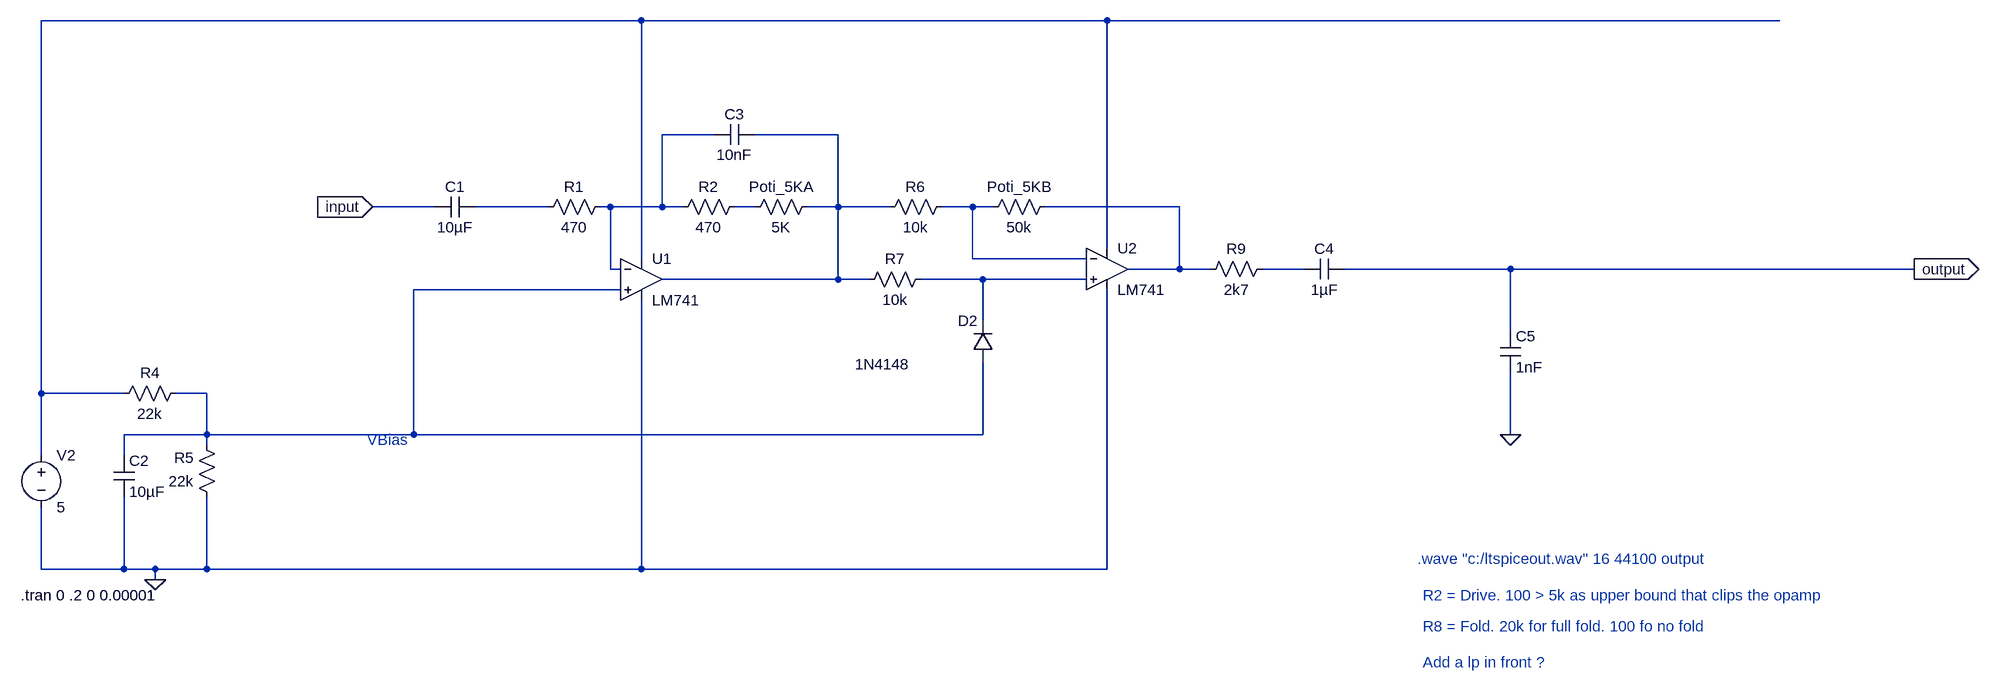
[diagram p0: schematic WaveFolder2.asc]
WaveFolder2.asc, the LTspice schematic file:
Version 4
SHEET 1 1856 720
WIRE -256 -288 -1184 -288
WIRE 464 -288 -256 -288
WIRE 1504 -288 464 -288
WIRE -144 -112 -224 -112
WIRE 48 -112 -80 -112
WIRE -576 0 -672 0
WIRE -400 0 -512 0
WIRE -304 0 -320 0
WIRE -224 0 -224 -112
WIRE -224 0 -304 0
WIRE -192 0 -224 0
WIRE -80 0 -112 0
WIRE 48 0 48 -112
WIRE 48 0 0 0
WIRE 128 0 48 0
WIRE 256 0 208 0
WIRE 288 0 256 0
WIRE 576 0 368 0
WIRE 464 64 464 -288
WIRE -256 80 -256 -288
WIRE 256 80 256 0
WIRE 432 80 256 80
WIRE -304 96 -304 0
WIRE -288 96 -304 96
WIRE 576 96 576 0
WIRE 576 96 496 96
WIRE 624 96 576 96
WIRE 768 96 704 96
WIRE 1088 96 832 96
WIRE 1712 96 1088 96
WIRE 48 112 48 0
WIRE 48 112 -224 112
WIRE 96 112 48 112
WIRE 272 112 176 112
WIRE 432 112 272 112
WIRE -288 128 -608 128
WIRE 272 176 272 112
WIRE 1088 192 1088 96
WIRE -1184 288 -1184 -288
WIRE -1056 288 -1184 288
WIRE -928 288 -976 288
WIRE -928 352 -928 288
WIRE -928 352 -1056 352
WIRE -608 352 -608 128
WIRE -608 352 -928 352
WIRE 272 352 272 240
WIRE 272 352 -608 352
WIRE 1088 352 1088 256
WIRE -928 368 -928 352
WIRE -1184 384 -1184 288
WIRE -1056 384 -1056 352
WIRE -1184 560 -1184 464
WIRE -1056 560 -1056 448
WIRE -1056 560 -1184 560
WIRE -1008 560 -1056 560
WIRE -928 560 -928 448
WIRE -928 560 -1008 560
WIRE -256 560 -256 144
WIRE -256 560 -928 560
WIRE 464 560 464 128
WIRE 464 560 -256 560
WIRE -1008 576 -1008 560
FLAG -1008 576 0
FLAG 1712 96 output
IOPIN 1712 96 Out
FLAG 1088 352 0
FLAG -672 0 input
IOPIN -672 0 In
SYMBOL cap -512 -16 R90
WINDOW 0 0 32 VBottom 2
WINDOW 3 32 32 VTop 2
SYMATTR InstName C1
SYMATTR Value 10µF
SYMBOL res -304 -16 R90
WINDOW 0 0 56 VBottom 2
WINDOW 3 32 56 VTop 2
SYMATTR InstName R1
SYMATTR Value 470
SYMBOL res -96 -16 R90
WINDOW 0 0 56 VBottom 2
WINDOW 3 32 56 VTop 2
SYMATTR InstName R2
SYMATTR Value 470
SYMBOL nostromo\\LM741 -256 48 R0
SYMATTR InstName U1
SYMBOL voltage -1184 368 R0
WINDOW 123 0 0 Left 2
WINDOW 39 0 0 Left 2
SYMATTR InstName V2
SYMATTR Value 5
SYMBOL diode 288 240 R180
WINDOW 0 24 64 Left 2
WINDOW 3 129 -3 Left 2
SYMATTR InstName D2
SYMATTR Value 1N4148
SYMBOL res 192 96 R90
WINDOW 0 0 56 VBottom 2
WINDOW 3 32 56 VTop 2
SYMATTR InstName R7
SYMATTR Value 10k
SYMBOL res -960 272 R90
WINDOW 0 0 56 VBottom 2
WINDOW 3 32 56 VTop 2
SYMATTR InstName R4
SYMATTR Value 22k
SYMBOL res -912 464 R180
WINDOW 0 36 76 Left 2
WINDOW 3 36 40 Left 2
SYMATTR InstName R5
SYMATTR Value 22k
SYMBOL cap -1072 384 R0
SYMATTR InstName C2
SYMATTR Value 10µF
SYMBOL nostromo\\LM741 464 32 R0
SYMATTR InstName U2
SYMBOL res 224 -16 R90
WINDOW 0 0 56 VBottom 2
WINDOW 3 32 56 VTop 2
SYMATTR InstName R6
SYMATTR Value 10k
SYMBOL res 384 -16 R90
WINDOW 0 0 56 VBottom 2
WINDOW 3 32 56 VTop 2
SYMATTR InstName Poti_5KB
SYMATTR Value 50k
SYMBOL res 720 80 R90
WINDOW 0 0 56 VBottom 2
WINDOW 3 32 56 VTop 2
SYMATTR InstName R9
SYMATTR Value 2k7
SYMBOL cap -80 -128 R90
WINDOW 0 0 32 VBottom 2
WINDOW 3 32 32 VTop 2
SYMATTR InstName C3
SYMATTR Value 10nF
SYMBOL cap 832 80 R90
WINDOW 0 0 32 VBottom 2
WINDOW 3 32 32 VTop 2
SYMATTR InstName C4
SYMATTR Value 1µF
SYMBOL cap 1072 192 R0
SYMATTR InstName C5
SYMATTR Value 1nF
SYMBOL res 16 -16 R90
WINDOW 0 0 56 VBottom 2
WINDOW 3 32 56 VTop 2
SYMATTR InstName Poti_5KA
SYMATTR Value 5K
TEXT -680 360 Left 2 ;VBias
TEXT -1216 600 Left 2 !.tran 0 .2 0 0.00001
TEXT 952 600 Left 2 ;R2 = Drive. 100 > 5k as upper bound that clips the opamp
TEXT 952 648 Left 2 ;R8 = Fold. 20k for full fold. 100 fo no fold
TEXT 944 544 Left 2 ;.wave "c:/ltspiceout.wav" 16 44100 output
TEXT 952 704 Left 2 ;Add a lp in front ?

The netlist it stands for:
* WaveFolder2.asc
C1 N004 input 10µF
R1 N002 N004 470
R2 N005 N002 470
XU1 N010 N002 N001 0 N003 LM741  ; pins In+ In- V+ V- OUT
V2 N001 0 5
D2 N010 N009 1N4148
R7 N009 N003 10k
R4 N010 N001 22k
R5 0 N010 22k
C2 N010 0 10µF
XU2 N009 N006 N001 0 N007 LM741  ; pins In+ In- V+ V- OUT
R6 N006 N003 10k
R§Poti_5KB N007 N006 50k
R9 N008 N007 2k7
C3 N003 N002 10nF
C4 output N008 1µF
C5 output 0 1nF
R§Poti_5KA N003 N005 5K
.model D D
.lib standard.dio
* VBias
.tran 0 .2 0 0.00001
* R2 = Drive. 100 > 5k as upper bound that clips the opamp
* R8 = Fold. 20k for full fold. 100 fo no fold
* .wave "c:/ltspiceout.wav" 16 44100 output
* Add a lp in front ?
.lib LM741.lib
.backanno
.end